# Altium project Astranis_Thermocouple.PrjPcb
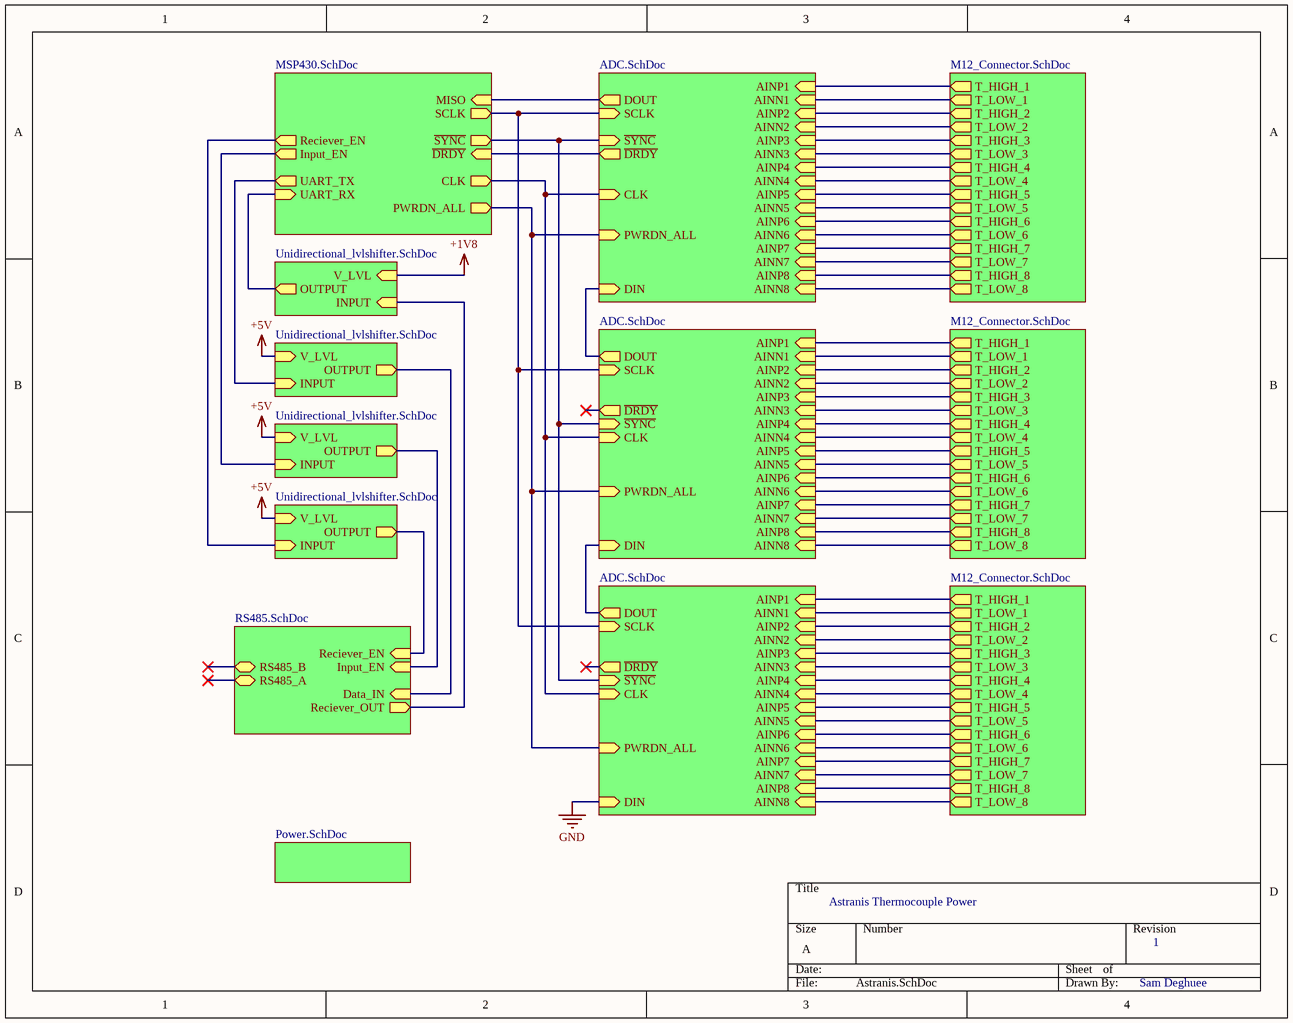
[diagram p0: Astranis.SchDoc]
7 sheets, 150 parts. Net scope: hierarchical (ports join the sheet entries above them; power ports are global).
Sheets:
  Astranis.SchDoc
    Designator = MSP430.SchDoc
    Designator = ADC.SchDoc
    Designator = M12_Connector.SchDoc
    Designator = ADC.SchDoc
    Designator = M12_Connector.SchDoc
    Designator = ADC.SchDoc
    Designator = M12_Connector.SchDoc
    Designator = Unidirectional_lvlshifter.SchDoc
    Designator = Unidirectional_lvlshifter.SchDoc
    Designator = RS485.SchDoc
    Designator = Unidirectional_lvlshifter.SchDoc
    Designator = Unidirectional_lvlshifter.SchDoc
    Designator = Power.SchDoc

## Sheet Astranis.SchDoc
size A

### Sub-sheets
Designator = MSP430.SchDoc: UART_TX (out), UART_RX (in), MISO (in), SCLK (out), PWRDN_ALL (out), ~{DRDY} (in), Input_EN (out), Reciever_EN (out), CLK (out), ~{SYNC} (out)
Designator = ADC.SchDoc: SCLK (in), ~{DRDY} (out), AINN8 (in), AINP3 (in), AINP5 (in), AINP7 (in), AINN7 (in), AINN5 (in), AINP2 (in), DOUT (out), PWRDN_ALL (in), AINN3 (in), AINN4 (in), AINN2 (in), AINN6 (in), AINP4 (in), AINP1 (in), ~{SYNC} (in), AINN1 (in), AINP6 (in), AINP8 (in), DIN (in), CLK (in)
Designator = M12_Connector.SchDoc: T_HIGH_1 (out), T_HIGH_5 (out), T_LOW_1 (out), T_HIGH_7 (out), T_LOW_2 (out), T_HIGH_4 (out), T_LOW_8 (out), T_LOW_3 (out), T_LOW_6 (out), T_HIGH_3 (out), T_HIGH_2 (out), T_HIGH_6 (out), T_LOW_7 (out), T_LOW_5 (out), T_LOW_4 (out), T_HIGH_8 (out)
Designator = ADC.SchDoc: SCLK (in), ~{DRDY} (out), AINN8 (in), AINP3 (in), AINP5 (in), AINP7 (in), AINN7 (in), AINN5 (in), AINP2 (in), DOUT (out), PWRDN_ALL (in), AINN3 (in), AINN4 (in), AINN2 (in), AINN6 (in), AINP4 (in), AINP1 (in), ~{SYNC} (in), AINN1 (in), AINP6 (in), AINP8 (in), DIN (in), CLK (in)
Designator = M12_Connector.SchDoc: T_HIGH_1 (out), T_HIGH_5 (out), T_LOW_1 (out), T_HIGH_7 (out), T_LOW_2 (out), T_HIGH_4 (out), T_LOW_8 (out), T_LOW_3 (out), T_LOW_6 (out), T_HIGH_3 (out), T_HIGH_2 (out), T_HIGH_6 (out), T_LOW_7 (out), T_LOW_5 (out), T_LOW_4 (out), T_HIGH_8 (out)
Designator = ADC.SchDoc: SCLK (in), ~{DRDY} (out), AINN8 (in), AINP3 (in), AINP5 (in), AINP7 (in), AINN7 (in), AINN5 (in), AINP2 (in), DOUT (out), PWRDN_ALL (in), AINN3 (in), AINN4 (in), AINN2 (in), AINN6 (in), AINP4 (in), AINP1 (in), ~{SYNC} (in), AINN1 (in), AINP6 (in), AINP8 (in), DIN (in), CLK (in)
Designator = M12_Connector.SchDoc: T_HIGH_1 (out), T_HIGH_5 (out), T_LOW_1 (out), T_HIGH_7 (out), T_LOW_2 (out), T_HIGH_4 (out), T_LOW_8 (out), T_LOW_3 (out), T_LOW_6 (out), T_HIGH_3 (out), T_HIGH_2 (out), T_HIGH_6 (out), T_LOW_7 (out), T_LOW_5 (out), T_LOW_4 (out), T_HIGH_8 (out)
Designator = Unidirectional_lvlshifter.SchDoc: V_LVL (in), OUTPUT (out), INPUT (in)
Designator = Unidirectional_lvlshifter.SchDoc: V_LVL (in), OUTPUT (out), INPUT (in)
Designator = RS485.SchDoc: RS485_B (bidir), Input_EN (in), Reciever_EN (in), Reciever_OUT (out), Data_IN (in), RS485_A (bidir)
Designator = Unidirectional_lvlshifter.SchDoc: V_LVL (in), OUTPUT (out), INPUT (in)
Designator = Unidirectional_lvlshifter.SchDoc: V_LVL (in), OUTPUT (out), INPUT (in)
Designator = Power.SchDoc: no entries

### Nets
+5V: sheet Designator/V_LVL, sheet Designator/V_LVL, sheet Designator/V_LVL
GND: sheet Designator/AINN8, sheet Designator/AINN7, sheet Designator/AINN5, sheet Designator/AINN3, sheet Designator/AINN4, sheet Designator/AINN2, sheet Designator/AINN6, sheet Designator/AINN1, sheet Designator/T_LOW_1, sheet Designator/T_LOW_2, sheet Designator/T_LOW_8, sheet Designator/T_LOW_3, sheet Designator/T_LOW_6, sheet Designator/T_LOW_7, sheet Designator/T_LOW_5, sheet Designator/T_LOW_4, sheet Designator/AINN8, sheet Designator/AINN7, sheet Designator/AINN5, sheet Designator/AINN3, sheet Designator/AINN4, sheet Designator/AINN2, sheet Designator/AINN6, sheet Designator/AINN1, sheet Designator/T_LOW_1, sheet Designator/T_LOW_2, sheet Designator/T_LOW_8, sheet Designator/T_LOW_3, sheet Designator/T_LOW_6, sheet Designator/T_LOW_7, sheet Designator/T_LOW_5, sheet Designator/T_LOW_4, sheet Designator/AINN8, sheet Designator/AINN7, sheet Designator/AINN5, sheet Designator/AINN3, sheet Designator/AINN4, sheet Designator/AINN2, sheet Designator/AINN6, sheet Designator/AINN1, sheet Designator/DIN, sheet Designator/T_LOW_1, sheet Designator/T_LOW_2, sheet Designator/T_LOW_8, sheet Designator/T_LOW_3, sheet Designator/T_LOW_6, sheet Designator/T_LOW_7, sheet Designator/T_LOW_5, sheet Designator/T_LOW_4
CLK: sheet Designator/CLK, sheet Designator/CLK, sheet Designator/CLK, sheet Designator/CLK
UART_RX: sheet Designator/UART_RX, sheet Designator/OUTPUT
UART_TX: sheet Designator/UART_TX, sheet Designator/INPUT
NetJ1_Designator#1_?1: sheet Designator/AINP1, sheet Designator/T_HIGH_1
NetJ1_Designator#2_?1: sheet Designator/AINP1, sheet Designator/T_HIGH_1
NetJ1_Designator#3_?1: sheet Designator/AINP1, sheet Designator/T_HIGH_1
NetJ2_Designator#1_?1: sheet Designator/AINP5, sheet Designator/T_HIGH_5
NetJ2_Designator#2_?1: sheet Designator/AINP5, sheet Designator/T_HIGH_5
NetJ2_Designator#3_?1: sheet Designator/AINP5, sheet Designator/T_HIGH_5
NetJ3_Designator#1_?1: sheet Designator/AINP2, sheet Designator/T_HIGH_2
NetJ3_Designator#2_?1: sheet Designator/AINP2, sheet Designator/T_HIGH_2
NetJ3_Designator#3_?1: sheet Designator/AINP2, sheet Designator/T_HIGH_2
NetJ4_Designator#1_?1: sheet Designator/AINP6, sheet Designator/T_HIGH_6
NetJ4_Designator#2_?1: sheet Designator/AINP6, sheet Designator/T_HIGH_6
NetJ4_Designator#3_?1: sheet Designator/AINP6, sheet Designator/T_HIGH_6
NetJ5_Designator#1_?1: sheet Designator/AINP3, sheet Designator/T_HIGH_3
NetJ5_Designator#2_?1: sheet Designator/AINP3, sheet Designator/T_HIGH_3
NetJ5_Designator#3_?1: sheet Designator/AINP3, sheet Designator/T_HIGH_3
NetJ6_Designator#1_?1: sheet Designator/AINP7, sheet Designator/T_HIGH_7
NetJ6_Designator#2_?1: sheet Designator/AINP7, sheet Designator/T_HIGH_7
NetJ6_Designator#3_?1: sheet Designator/AINP7, sheet Designator/T_HIGH_7
NetJ7_Designator#1_?1: sheet Designator/AINP4, sheet Designator/T_HIGH_4
NetJ7_Designator#2_?1: sheet Designator/AINP4, sheet Designator/T_HIGH_4
NetJ7_Designator#3_?1: sheet Designator/AINP4, sheet Designator/T_HIGH_4
NetJ8_Designator#1_?1: sheet Designator/AINP8, sheet Designator/T_HIGH_8
NetJ8_Designator#2_?1: sheet Designator/AINP8, sheet Designator/T_HIGH_8
NetJ8_Designator#3_?1: sheet Designator/AINP8, sheet Designator/T_HIGH_8
NetQ1_Designator#2_3: sheet Designator/OUTPUT, sheet Designator/Data_IN
NetQ1_Designator#3_3: sheet Designator/Reciever_EN, sheet Designator/OUTPUT
NetQ1_Designator#4_3: sheet Designator/Input_EN, sheet Designator/OUTPUT
NetR12_Designator#1_1: sheet Designator/INPUT, sheet Designator/Reciever_OUT
NetR12_Designator#3_1: sheet Designator/Reciever_EN, sheet Designator/INPUT
NetR12_Designator#4_1: sheet Designator/Input_EN, sheet Designator/INPUT
NetU1_Designator#1_?1: sheet Designator/DIN, sheet Designator/DOUT
NetU1_Designator#1_?2: sheet Designator/~{DRDY}, sheet Designator/~{DRDY}
NetU1_Designator#1_?4: sheet Designator/~{SYNC}, sheet Designator/~{SYNC}, sheet Designator/~{SYNC}, sheet Designator/~{SYNC}
NetU1_Designator#1_?13: sheet Designator/PWRDN_ALL, sheet Designator/PWRDN_ALL, sheet Designator/PWRDN_ALL, sheet Designator/PWRDN_ALL
NetU1_Designator#1_?24: sheet Designator/MISO, sheet Designator/DOUT
NetU1_Designator#1_SCLK: sheet Designator/SCLK, sheet Designator/SCLK, sheet Designator/SCLK, sheet Designator/SCLK
NetU1_Designator#2_?1: sheet Designator/DIN, sheet Designator/DOUT

### Notes on the sheet
- Astranis Thermocouple Power
- 1
- Sam Deghuee

## Sheet MSP430.SchDoc
size A
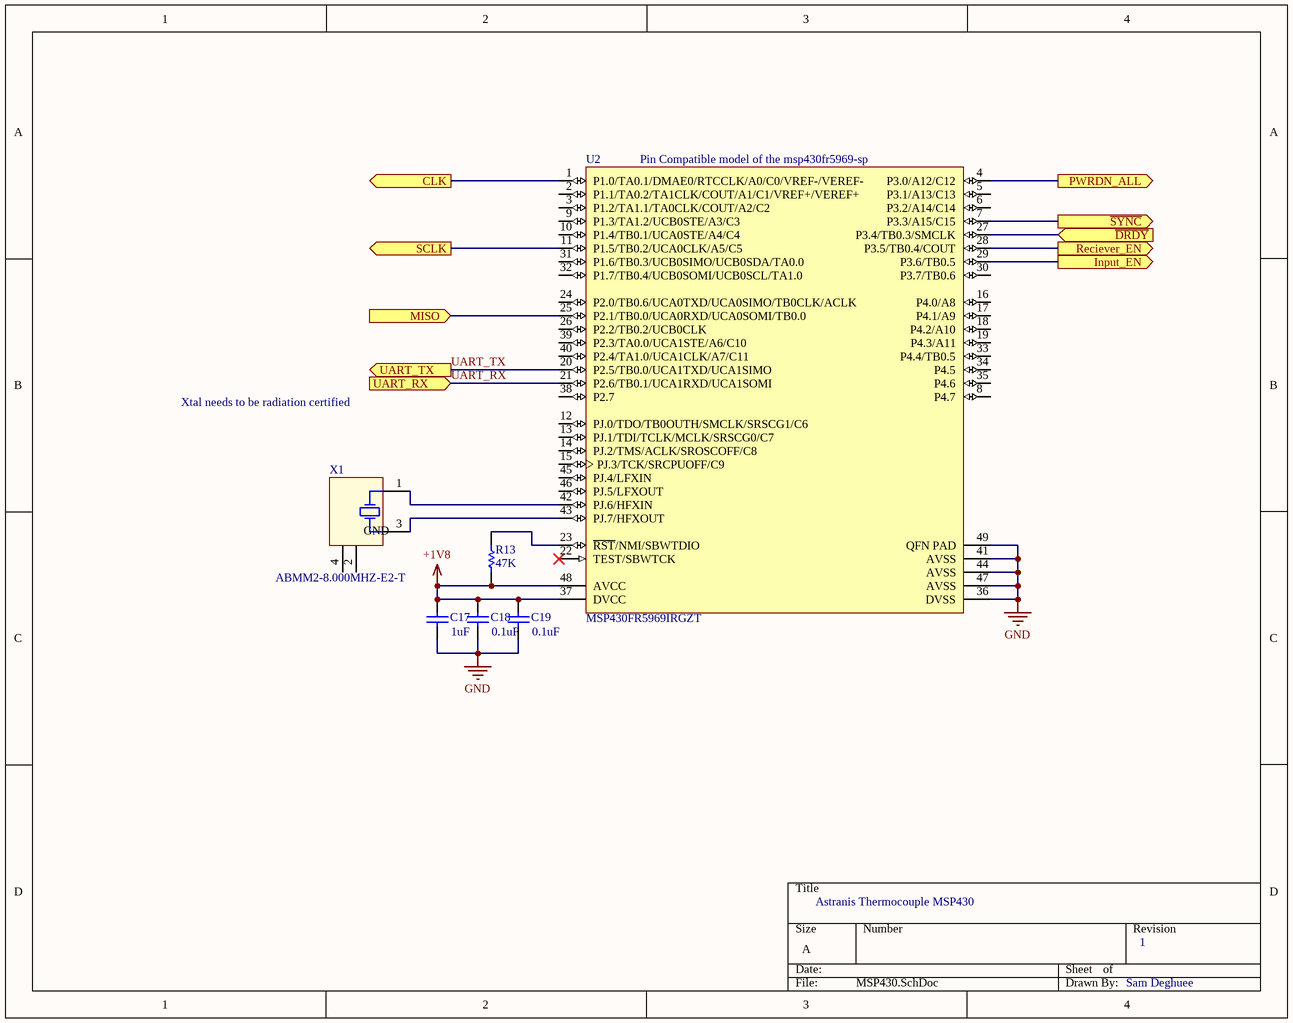
[diagram p1: MSP430.SchDoc]

### Parts
C17  value 1uF  [CAPC0603(1608)100_L]  (hidden comment: CAP0603)
C18  value 0.1uF  [CAPC0603(1608)100_L]  (hidden comment: CAP0603)
C19  value 0.1uF  [CAPC0603(1608)100_L]  (hidden comment: CAP0603)
R13  value 47K  [RESC0603(1608)_L]  (hidden comment: RES0603)
U2  MSP430FR5969IRGZT  [RGZ0048B_V]
X1  ABMM2-8.000MHZ-E2-T  [ABRA-ABMM2-4_V]

### Ports
CLK (out), Input_EN (out), MISO (in), PWRDN_ALL (out), Reciever_EN (out), SCLK (out), UART_RX (in), UART_TX (out), ~{DRDY} (in), ~{SYNC} (out)

### Nets
+1V8: C17.2 C18.2 C19.2 R13.2 U2.37(DVCC) U2.48(AVCC)
GND: C17.1 C18.1 C19.1 U2.36(DVSS) U2.41(AVSS) U2.44(AVSS) U2.47(AVSS) U2.49(QFN_PAD)
CLK: U2.1(P1.0/TA0.1/DMAE0/RTCCLK/A0/C0/VREF-/VEREF-) ; port CLK
UART_RX: U2.21(P2.6/TB0.1/UCA1RXD/UCA1SOMI) ; port UART_RX
UART_TX: U2.20(P2.5/TB0.0/UCA1TXD/UCA1SIMO) ; port UART_TX
NetR12_Designator#3_1: U2.28(P3.5/TB0.4/COUT) ; port Reciever_EN
NetR12_Designator#4_1: U2.29(P3.6/TB0.5) ; port Input_EN
NetR13_1: R13.1 U2.23(~{RST}/NMI/SBWTDIO)
NetU1_Designator#1_?2: U2.27(P3.4/TB0.3/SMCLK) ; port ~{DRDY}
NetU1_Designator#1_?4: U2.7(P3.3/A15/C15) ; port ~{SYNC}
NetU1_Designator#1_?13: U2.4(P3.0/A12/C12) ; port PWRDN_ALL
NetU1_Designator#1_?24: U2.25(P2.1/TB0.0/UCA0RXD/UCA0SOMI/TB0.0) ; port MISO
NetU1_Designator#1_SCLK: U2.11(P1.5/TB0.2/UCA0CLK/A5/C5) ; port SCLK
NetU2_42: U2.42(PJ.6/HFXIN) X1.1(X1)
NetU2_43: U2.43(PJ.7/HFXOUT) X1.3(X2)

Not connected (* = marked no-connect by the designer): U2 2(P1.1/TA0.2/TA1CLK/COUT/A1/C1/VREF+/VEREF+) 3(P1.2/TA1.1/TA0CLK/COUT/A2/C2) 5(P3.1/A13/C13) 6(P3.2/A14/C14) 8(P4.7) 9(P1.3/TA1.2/UCB0STE/A3/C3) 10(P1.4/TB0.1/UCA0STE/A4/C4) 12(PJ.0/TDO/TB0OUTH/SMCLK/SRSCG1/C6) 13(PJ.1/TDI/TCLK/MCLK/SRSCG0/C7) 14(PJ.2/TMS/ACLK/SROSCOFF/C8) 15(PJ.3/TCK/SRCPUOFF/C9) 16(P4.0/A8) 17(P4.1/A9) 18(P4.2/A10) 19(P4.3/A11) 22(TEST/SBWTCK)* 24(P2.0/TB0.6/UCA0TXD/UCA0SIMO/TB0CLK/ACLK) 26(P2.2/TB0.2/UCB0CLK) 30(P3.7/TB0.6) 31(P1.6/TB0.3/UCB0SIMO/UCB0SDA/TA0.0) 32(P1.7/TB0.4/UCB0SOMI/UCB0SCL/TA1.0) 33(P4.4/TB0.5) 34(P4.5) 35(P4.6) 38(P2.7) 39(P2.3/TA0.0/UCA1STE/A6/C10) 40(P2.4/TA1.0/UCA1CLK/A7/C11) 45(PJ.4/LFXIN) 46(PJ.5/LFXOUT); X1 2(GND) 4(GND)

### Notes on the sheet
- (near U2) Pin Compatible model of the msp430fr5969-sp
- Xtal needs to be radiation certified
- Astranis Thermocouple MSP430
- 1
- Sam Deghuee

### Library data of the parts
C17-C19 = CMP-1590-00005-1: 0603 (1608 Metric) Chip Capacitor; Case-Metric: 1608; Case-EIA: 0603; PackageReference: CAPC0603(1608)100
R13 = CMP-1591-00001-1: 0603 (1608 Metric) Chip Resistor; Case-Metric: 1608; Case-EIA: 0603; PackageReference: RESC0603(1608)
U2 = CMP-2000-06762-1: 16 MHz Mixed Signal Microcontroller with 2 KB SRAM and 40 GPIOs, -40 to 85 degC, 48-Pin QFN (RGZ), Green (RoHS & no Sb/Br), Tape and Reel; Manufacturer: Texas Instruments; Maximum Frequency: 16MHz; Number of SPI Channels: 3; ADC Channels: 16; Device Core: MSP430; ADC Resolution: 12bit; Program Memory Size: 64kB; Number of UART Channels: 2; ADCs: 1(16x12bit); Data Bus Width: 16bit; Number of ADC Units: 1; Timers: 5x16bit; Instruction Set Architecture: RISC; Program Memory Type: Flash; RAM Size: 2kB; Typical Operating Supply Voltage: 1.8→3.6V; Number of Timers: 5; Pin Count: 48; Width: 7.15mm; Package Type: VQFN; Minimum Operating Temperature: -40°C; Maximum Operating Temperature: +85°C; Datasheet URL: http://www.ti.com/lit/ds/symlink/msp430fr5969.pdf; Mounting Type: SurfaceMount; Package Description: 48-Pin Quad Flat No-lead Package, Body 7 x 7 mm, Pitch 0.5 mm; Timer Resolution: 16bit; Manufacturer URL: http://www.ti.com/; Height: 0.95mm; Datasheet Version: Rev. E, 03/2015; Dimensions: 7.15x7.15x0.95mm; Mounting Technology: SurfaceMount; Package Reference: RGZ48-4100X4100TP; Number of I2C Channels: 1; Family Name: MSP430; Length: 7.15mm; Number of LIN Channels: 2; ComponentLink1Description: Space Datasheet; ComponentLink1URL: http://www.ti.com/lit/ds/symlink/msp430fr5969-sp.pdf
X1 = CMP-0277-00003-1: Ceramic Surface Mount Low Profile Quartz Crystal, 8 MHz, -20 to 70 degC, 4-Pin 6 x 3.6 x 1.2 mm SMD, RoHS, 1000pcs / Reel; Manufacturer: Abracon; ESR: 72 Ohm Max.; Frequency: 8 MHz; Shunt Capacitance C0: 7 pF Max.; Load Capacitance CL: 18 pF Typ.; ComponentLink3Description: Package Specification; PackageDescription: 4-Pin SMD, Body 6 x 3.6 mm, Pitch 4.4 mm; DatasheetVersion: Jan-13; ComponentLink1URL: http://www.abracon.com/; ComponentLink2URL: http://www.abracon.com/Resonators/ABMM2.pdf; Temperature Range: -20 to 70 degC; Mounting Technology: Surface Mount; RoHS: TRUE; PartNumber: ABMM2-8.000MHZ-E2-T; ComponentLink2Description: Datasheet; ComponentLink3URL: http://www.abracon.com/Resonators/ABMM2.pdf; ComponentLink1Description: Manufacturer URL; Packing: 1000pcs / Reel

## Sheet ADC.SchDoc
size A
Used 3 times, as channels Designator, Designator, Designator. Parts and nets are listed once, with the designators drawn on the sheet.
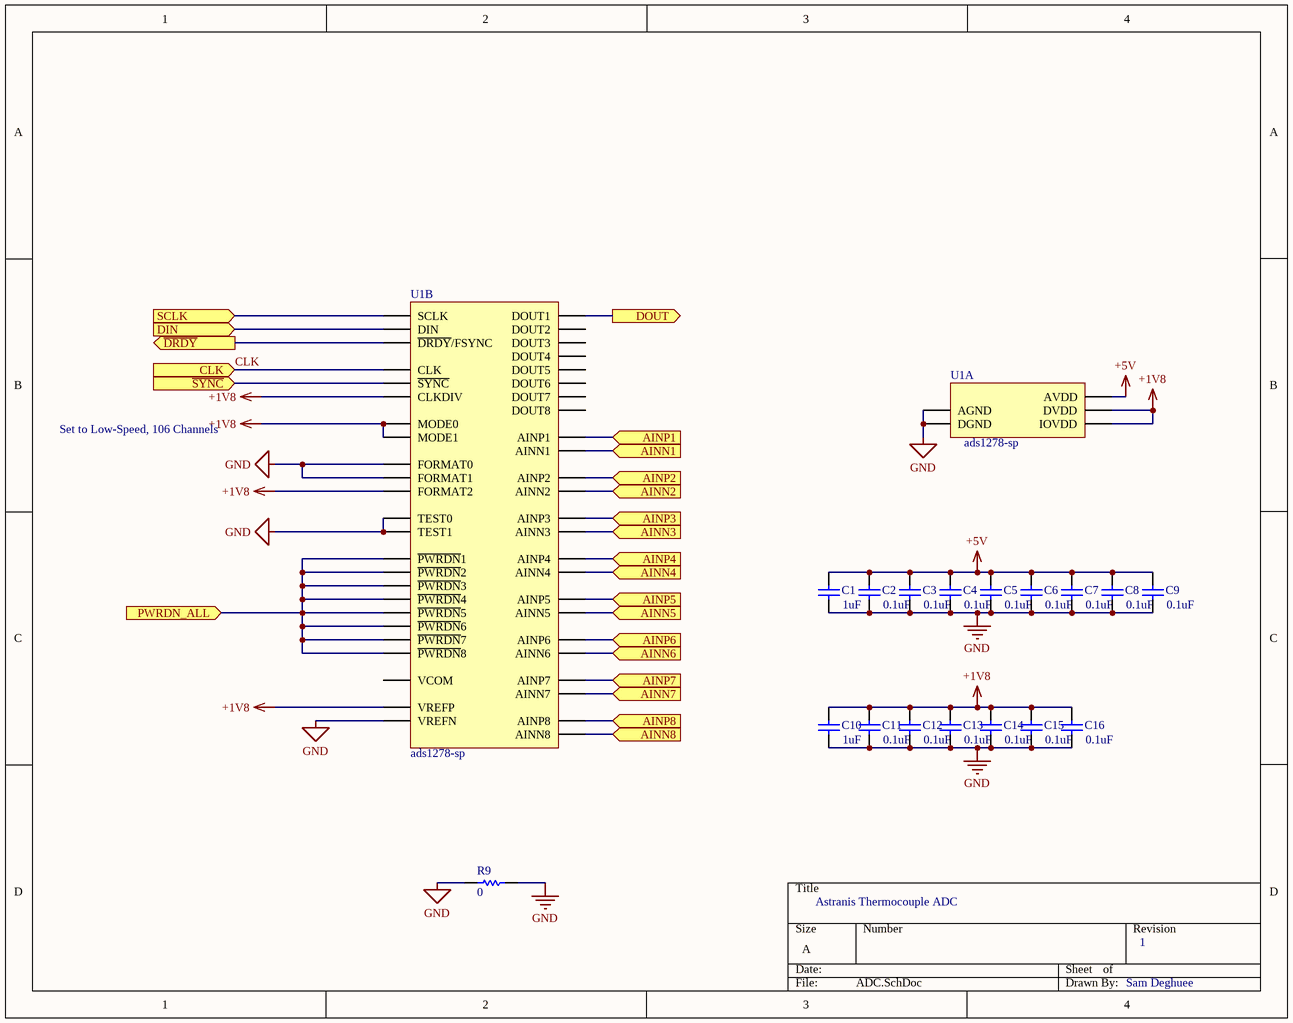
[diagram p2: ADC.SchDoc]

### Parts
C1  value 1uF  [CAPC0603(1608)100_L]  (hidden comment: CAP0603)
C2  value 0.1uF  [CAPC0603(1608)100_L]  (hidden comment: CAP0603)
C3  value 0.1uF  [CAPC0603(1608)100_L]  (hidden comment: CAP0603)
C4  value 0.1uF  [CAPC0603(1608)100_L]  (hidden comment: CAP0603)
C5  value 0.1uF  [CAPC0603(1608)100_L]  (hidden comment: CAP0603)
C6  value 0.1uF  [CAPC0603(1608)100_L]  (hidden comment: CAP0603)
C7  value 0.1uF  [CAPC0603(1608)100_L]  (hidden comment: CAP0603)
C8  value 0.1uF  [CAPC0603(1608)100_L]  (hidden comment: CAP0603)
C9  value 0.1uF  [CAPC0603(1608)100_L]  (hidden comment: CAP0603)
C10  value 1uF  [CAPC0603(1608)100_L]  (hidden comment: CAP0603)
C11  value 0.1uF  [CAPC0603(1608)100_L]  (hidden comment: CAP0603)
C12  value 0.1uF  [CAPC0603(1608)100_L]  (hidden comment: CAP0603)
C13  value 0.1uF  [CAPC0603(1608)100_L]  (hidden comment: CAP0603)
C14  value 0.1uF  [CAPC0603(1608)100_L]  (hidden comment: CAP0603)
C15  value 0.1uF  [CAPC0603(1608)100_L]  (hidden comment: CAP0603)
C16  value 0.1uF  [CAPC0603(1608)100_L]  (hidden comment: CAP0603)
R9  value 0  [RESC0603(1608)_L]  (hidden comment: RES0603)
U1  ads1278-sp  (parts A,B of 2)

### Ports
AINN1 (in), AINN2 (in), AINN3 (in), AINN4 (in), AINN5 (in), AINN6 (in), AINN7 (in), AINN8 (in), AINP1 (in), AINP2 (in), AINP3 (in), AINP4 (in), AINP5 (in), AINP6 (in), AINP7 (in), AINP8 (in), CLK (in), DIN (in), DOUT (out), PWRDN_ALL (in), SCLK (in), ~{DRDY} (out), ~{SYNC} (in)

### Nets
+1V8: C10.2 C11.2 C12.2 C13.2 C14.2 C15.2 C16.2 U1.?5(CLKDIV) U1.?6(MODE0) U1.?7(MODE1) U1.?10(FORMAT2) U1.?22(VREFP) U1.DVDD U1.IOVDD
+5V: C1.2 C2.2 C3.2 C4.2 C5.2 C6.2 C7.2 C8.2 C9.2 U1.AVDD
GND: C1.1 C2.1 C3.1 C4.1 C5.1 C6.1 C7.1 C8.1 C9.1 C10.1 C11.1 C12.1 C13.1 C14.1 C15.1 C16.1 R9.1 R9.2 U1.?8(FORMAT0) U1.?9(FORMAT1) U1.?11(TEST0) U1.?12(TEST1) U1.?23(VREFN) U1.AGND U1.DGND
AINN1: U1.?40(AINN1) ; port AINN1
AINN2: U1.?41(AINN2) ; port AINN2
AINN3: U1.?42(AINN3) ; port AINN3
AINN4: U1.?43(AINN4) ; port AINN4
AINN5: U1.?44(AINN5) ; port AINN5
AINN6: U1.?45(AINN6) ; port AINN6
AINN7: U1.?46(AINN7) ; port AINN7
AINN8: U1.?47(AINN8) ; port AINN8
AINP1: U1.?32(AINP1) ; port AINP1
AINP2: U1.?33(AINP2) ; port AINP2
AINP3: U1.?34(AINP3) ; port AINP3
AINP4: U1.?35(AINP4) ; port AINP4
AINP5: U1.?36(AINP5) ; port AINP5
AINP6: U1.?37(AINP6) ; port AINP6
AINP7: U1.?38(AINP7) ; port AINP7
AINP8: U1.?39(AINP8) ; port AINP8
CLK: U1.?3(CLK) ; port CLK
~{DRDY}: U1.?2(~{DRDY}/FSYNC) ; port ~{DRDY}
DIN: U1.?1(DIN) ; port DIN
DOUT: U1.?24(DOUT1) ; port DOUT
PWRDN_ALL: U1.?13(~{PWRDN}1) U1.?14(~{PWRDN}2) U1.?15(~{PWRDN}3) U1.?16(~{PWRDN}4) U1.?17(~{PWRDN}5) U1.?18(~{PWRDN}6) U1.?19(~{PWRDN}7) U1.?20(~{PWRDN}8) ; port PWRDN_ALL
~{SYNC}: U1.?4(~{SYNC}) ; port ~{SYNC}
SCLK: U1.SCLK ; port SCLK

Not connected (* = marked no-connect by the designer): U1 ?21(VCOM) ?25(DOUT2) ?26(DOUT3) ?27(DOUT4) ?28(DOUT5) ?29(DOUT6) ?30(DOUT7) ?31(DOUT8)

### Channels
Designator: designators end in _Designator#1; ports AINN1=GND AINN2=GND AINN3=GND AINN4=GND AINN5=GND AINN6=GND AINN7=GND AINN8=GND AINP1=NetJ1_Designator#1_?1 AINP2=NetJ3_Designator#1_?1 AINP3=NetJ5_Designator#1_?1 AINP4=NetJ7_Designator#1_?1 AINP5=NetJ2_Designator#1_?1 AINP6=NetJ4_Designator#1_?1 AINP7=NetJ6_Designator#1_?1 AINP8=NetJ8_Designator#1_?1 CLK=CLK DIN=NetU1_Designator#1_?1 DOUT=NetU1_Designator#1_?24 PWRDN_ALL=NetU1_Designator#1_?13 SCLK=NetU1_Designator#1_SCLK ~{DRDY}=NetU1_Designator#1_?2 ~{SYNC}=NetU1_Designator#1_?4
Designator: designators end in _Designator#2; ports AINN1=GND AINN2=GND AINN3=GND AINN4=GND AINN5=GND AINN6=GND AINN7=GND AINN8=GND AINP1=NetJ1_Designator#2_?1 AINP2=NetJ3_Designator#2_?1 AINP3=NetJ5_Designator#2_?1 AINP4=NetJ7_Designator#2_?1 AINP5=NetJ2_Designator#2_?1 AINP6=NetJ4_Designator#2_?1 AINP7=NetJ6_Designator#2_?1 AINP8=NetJ8_Designator#2_?1 CLK=CLK DIN=NetU1_Designator#2_?1 DOUT=NetU1_Designator#1_?1 PWRDN_ALL=NetU1_Designator#1_?13 SCLK=NetU1_Designator#1_SCLK ~{DRDY}=NetU1_Designator#2_?2 ~{SYNC}=NetU1_Designator#1_?4
Designator: designators end in _Designator#3; ports AINN1=GND AINN2=GND AINN3=GND AINN4=GND AINN5=GND AINN6=GND AINN7=GND AINN8=GND AINP1=NetJ1_Designator#3_?1 AINP2=NetJ3_Designator#3_?1 AINP3=NetJ5_Designator#3_?1 AINP4=NetJ7_Designator#3_?1 AINP5=NetJ2_Designator#3_?1 AINP6=NetJ4_Designator#3_?1 AINP7=NetJ6_Designator#3_?1 AINP8=NetJ8_Designator#3_?1 CLK=CLK DIN=GND DOUT=NetU1_Designator#2_?1 PWRDN_ALL=NetU1_Designator#1_?13 SCLK=NetU1_Designator#1_SCLK ~{DRDY}=NetU1_Designator#3_?2 ~{SYNC}=NetU1_Designator#1_?4

### Notes on the sheet
- Set to Low-Speed, 106 Channels
- Astranis Thermocouple ADC
- 1
- Sam Deghuee

### Library data of the parts
C1-C16 = CMP-1590-00005-1: as C17 on sheet MSP430; PackageReference: CAPC0603(1608)100
R9 = CMP-1591-00001-1: as R13 on sheet MSP430; PackageReference: RESC0603(1608)
U1 = ads1278-sp: The ADS1278-SP (octal) is a 24-bit, delta-sigma (ΔΣ) analog-to-digital converter (ADC) with data rates up to 128k samples per second (SPS), allowing simultaneous sampling of eight channels.; ComponentLink1Description: Datasheet; ComponentLink1URL: http://www.ti.com/lit/ds/symlink/ads1278-sp.pdf

## Sheet M12_Connector.SchDoc
size A
Used 3 times, as channels Designator, Designator, Designator. Parts and nets are listed once, with the designators drawn on the sheet.
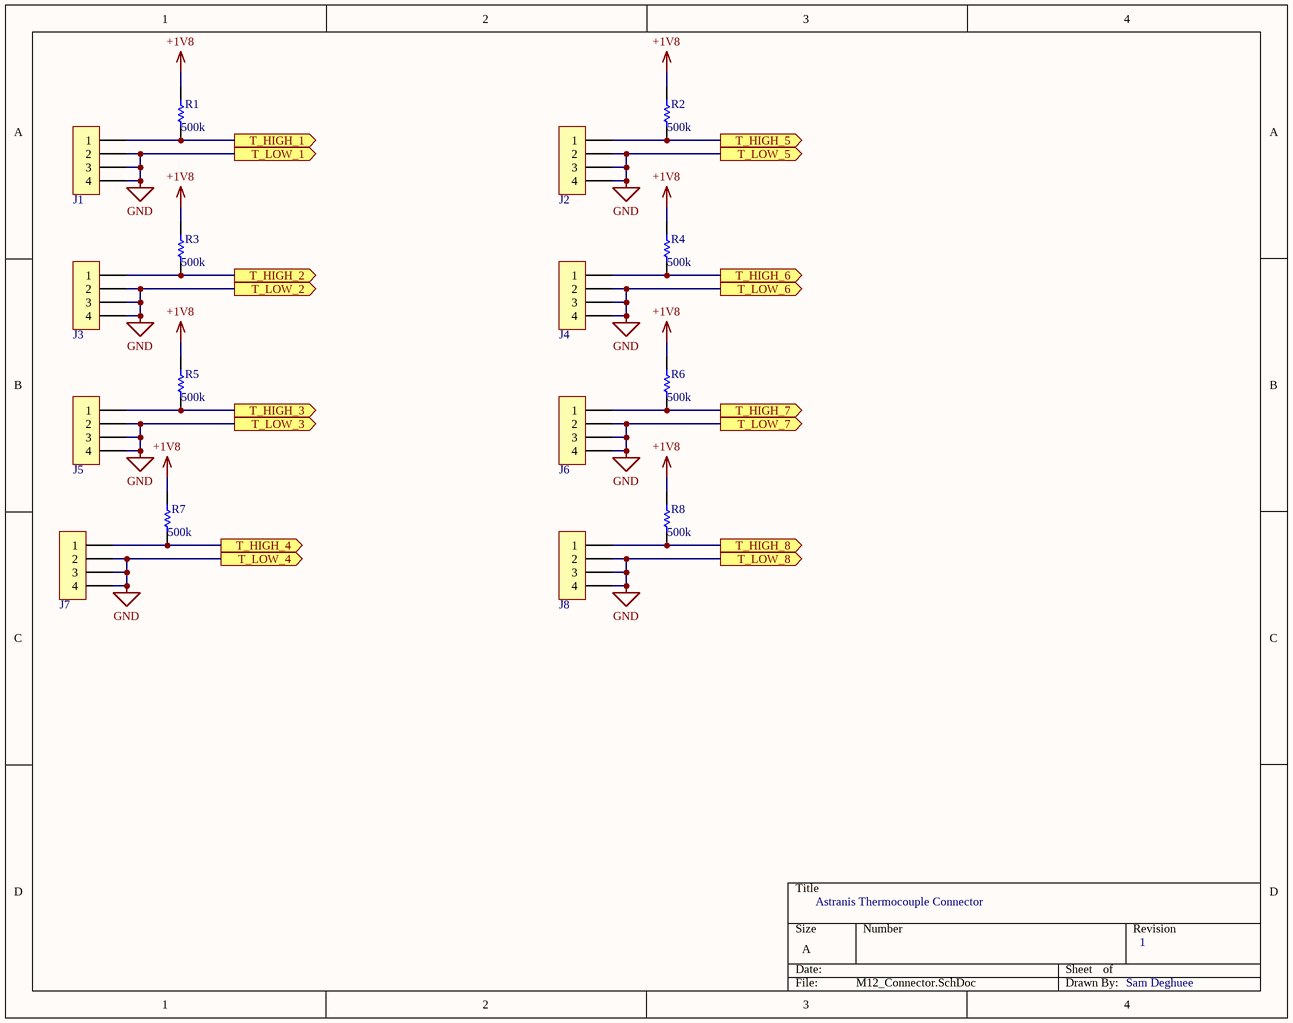
[diagram p3: M12_Connector.SchDoc]

### Parts
J1  M12 PCB Pannel Mount  (value not drawn)
J2  M12 PCB Pannel Mount  (value not drawn)
J3  M12 PCB Pannel Mount  (value not drawn)
J4  M12 PCB Pannel Mount  (value not drawn)
J5  M12 PCB Pannel Mount  (value not drawn)
J6  M12 PCB Pannel Mount  (value not drawn)
J7  M12 PCB Pannel Mount  (value not drawn)
J8  M12 PCB Pannel Mount  (value not drawn)
R1  value 500k  [RESC0603(1608)_L]  (hidden comment: RES0603)
R2  value 500k  [RESC0603(1608)_L]  (hidden comment: RES0603)
R3  value 500k  [RESC0603(1608)_L]  (hidden comment: RES0603)
R4  value 500k  [RESC0603(1608)_L]  (hidden comment: RES0603)
R5  value 500k  [RESC0603(1608)_L]  (hidden comment: RES0603)
R6  value 500k  [RESC0603(1608)_L]  (hidden comment: RES0603)
R7  value 500k  [RESC0603(1608)_L]  (hidden comment: RES0603)
R8  value 500k  [RESC0603(1608)_L]  (hidden comment: RES0603)

### Ports
T_HIGH_1 (out), T_HIGH_2 (out), T_HIGH_3 (out), T_HIGH_4 (out), T_HIGH_5 (out), T_HIGH_6 (out), T_HIGH_7 (out), T_HIGH_8 (out), T_LOW_1 (out), T_LOW_2 (out), T_LOW_3 (out), T_LOW_4 (out), T_LOW_5 (out), T_LOW_6 (out), T_LOW_7 (out), T_LOW_8 (out)

### Nets
+1V8: R1.2 R2.2 R3.2 R4.2 R5.2 R6.2 R7.2 R8.2
GND: J1.?2(2) J1.?3(3) J1.?4(4) J2.?2(2) J2.?3(3) J2.?4(4) J3.?2(2) J3.?3(3) J3.?4(4) J4.?2(2) J4.?3(3) J4.?4(4) J5.?2(2) J5.?3(3) J5.?4(4) J6.?2(2) J6.?3(3) J6.?4(4) J7.?2(2) J7.?3(3) J7.?4(4) J8.?2(2) J8.?3(3) J8.?4(4) ; port T_LOW_1, port T_LOW_2, port T_LOW_3, port T_LOW_4, port T_LOW_5, port T_LOW_6, port T_LOW_7, port T_LOW_8
T_HIGH_1: J1.?1(1) R1.1 ; port T_HIGH_1
T_HIGH_2: J3.?1(1) R3.1 ; port T_HIGH_2
T_HIGH_3: J5.?1(1) R5.1 ; port T_HIGH_3
T_HIGH_4: J7.?1(1) R7.1 ; port T_HIGH_4
T_HIGH_5: J2.?1(1) R2.1 ; port T_HIGH_5
T_HIGH_6: J4.?1(1) R4.1 ; port T_HIGH_6
T_HIGH_7: J6.?1(1) R6.1 ; port T_HIGH_7
T_HIGH_8: J8.?1(1) R8.1 ; port T_HIGH_8

### Channels
Designator: designators end in _Designator#1; ports T_HIGH_1=NetJ1_Designator#1_?1 T_HIGH_2=NetJ3_Designator#1_?1 T_HIGH_3=NetJ5_Designator#1_?1 T_HIGH_4=NetJ7_Designator#1_?1 T_HIGH_5=NetJ2_Designator#1_?1 T_HIGH_6=NetJ4_Designator#1_?1 T_HIGH_7=NetJ6_Designator#1_?1 T_HIGH_8=NetJ8_Designator#1_?1 T_LOW_1=GND T_LOW_2=GND T_LOW_3=GND T_LOW_4=GND T_LOW_5=GND T_LOW_6=GND T_LOW_7=GND T_LOW_8=GND
Designator: designators end in _Designator#2; ports T_HIGH_1=NetJ1_Designator#2_?1 T_HIGH_2=NetJ3_Designator#2_?1 T_HIGH_3=NetJ5_Designator#2_?1 T_HIGH_4=NetJ7_Designator#2_?1 T_HIGH_5=NetJ2_Designator#2_?1 T_HIGH_6=NetJ4_Designator#2_?1 T_HIGH_7=NetJ6_Designator#2_?1 T_HIGH_8=NetJ8_Designator#2_?1 T_LOW_1=GND T_LOW_2=GND T_LOW_3=GND T_LOW_4=GND T_LOW_5=GND T_LOW_6=GND T_LOW_7=GND T_LOW_8=GND
Designator: designators end in _Designator#3; ports T_HIGH_1=NetJ1_Designator#3_?1 T_HIGH_2=NetJ3_Designator#3_?1 T_HIGH_3=NetJ5_Designator#3_?1 T_HIGH_4=NetJ7_Designator#3_?1 T_HIGH_5=NetJ2_Designator#3_?1 T_HIGH_6=NetJ4_Designator#3_?1 T_HIGH_7=NetJ6_Designator#3_?1 T_HIGH_8=NetJ8_Designator#3_?1 T_LOW_1=GND T_LOW_2=GND T_LOW_3=GND T_LOW_4=GND T_LOW_5=GND T_LOW_6=GND T_LOW_7=GND T_LOW_8=GND

### Notes on the sheet
- Astranis Thermocouple Connector
- 1
- Sam Deghuee

### Library data of the parts
J1-J8 = M12: M12,REAR MOUNTING,MALE,A CODE,4P
R1-R8 = CMP-1591-00001-1: as R13 on sheet MSP430; PackageReference: RESC0603(1608)

## Sheet Unidirectional_lvlshifter.SchDoc
size A
Used 4 times, as channels Designator, Designator, Designator, Designator. Parts and nets are listed once, with the designators drawn on the sheet.
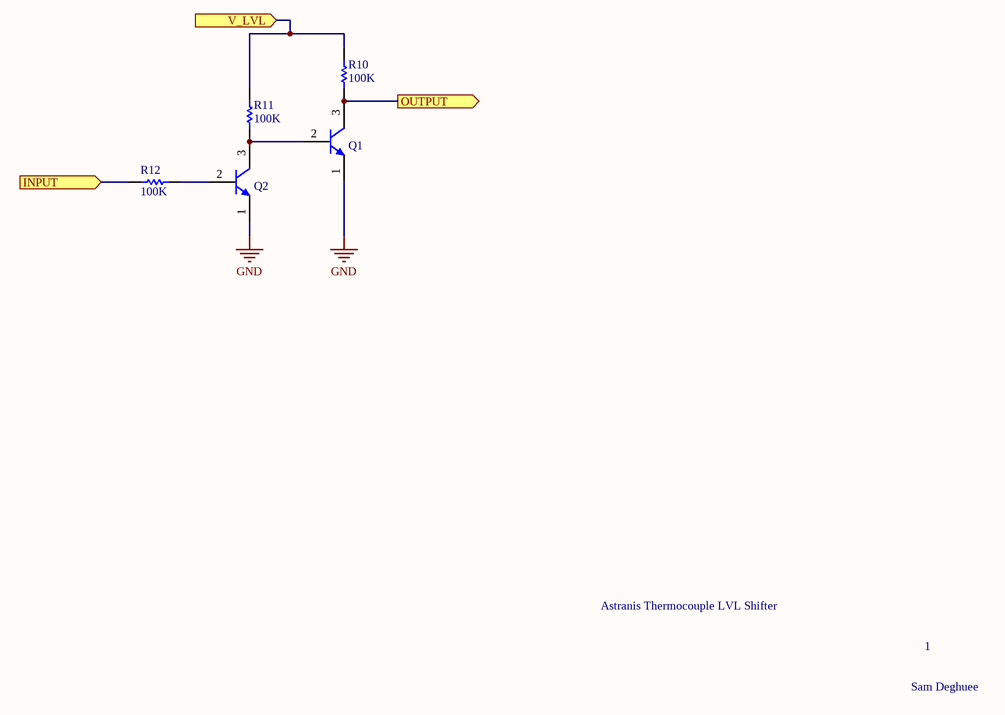
[diagram p4: Unidirectional_lvlshifter.SchDoc]

### Parts
Q1  MPSA18G  [ONSC-TO-92-3-29-11]  (value not drawn)
Q2  MPSA18G  [ONSC-TO-92-3-29-11]  (value not drawn)
R10  value 100K  [RESC0603(1608)_L]  (hidden comment: RES0603)
R11  value 100K  [RESC0603(1608)_L]  (hidden comment: RES0603)
R12  value 100K  [RESC0603(1608)_L]  (hidden comment: RES0603)

### Ports
INPUT (in), OUTPUT (out), V_LVL (in)

### Nets
GND: Q1.1(E) Q2.1(E)
INPUT: R12.1 ; port INPUT
OUTPUT: Q1.3(C) R10.2 ; port OUTPUT
V_LVL: R10.1 R11.1 ; port V_LVL
NetQ1_2: Q1.2(B) Q2.3(C) R11.2
NetQ2_2: Q2.2(B) R12.2

### Channels
Designator: designators end in _Designator#1; ports INPUT=NetR12_Designator#1_1 OUTPUT=UART_RX V_LVL=+1V8
Designator: designators end in _Designator#2; ports INPUT=UART_TX OUTPUT=NetQ1_Designator#2_3 V_LVL=+5V
Designator: designators end in _Designator#3; ports INPUT=NetR12_Designator#3_1 OUTPUT=NetQ1_Designator#3_3 V_LVL=+5V
Designator: designators end in _Designator#4; ports INPUT=NetR12_Designator#4_1 OUTPUT=NetQ1_Designator#4_3 V_LVL=+5V

### Notes on the sheet
- Astranis Thermocouple LVL Shifter
- 1
- Sam Deghuee

### Library data of the parts
Q1 Q2 = CMP-1048-01396-1: Low Noise Transistor, NPN Silicon, 3-Pin TO-92, Pb-Free, Bulk Box; Manufacturer: On Semiconductor; IC Continuous (A): 0.2; fT Min (MHz): 100; PackageDescription: 3-Pin Transistor Outline, Body 4.825 x 3.685 mm, Pitch 1.27 mm; ComponentLink2URL: http://www.onsemi.cn/pub_link/Collateral/MPSA18-D.PDF; PackageVersion: Rev. AM; DatasheetVersion: Rev. 4; ComponentLink3URL: http://www.onsemi.cn/pub_link/Collateral/2N6426-D.PDF; Packing: Bulk Box; ComponentLink3Description: Package Specification; Polarity: NPN; RoHS: TRUE; ComponentLink2Description: Datasheet; ComponentLink1Description: Manufacturer URL; ComponentLink1URL: http://www.onsemi.com/; PartNumber: MPSA18G; Mounting Technology: Through Hole; PackageReference: TO-92-3-29-11_AM_SL
R10-R12 = CMP-1591-00001-1: as R13 on sheet MSP430; PackageReference: RESC0603(1608)

## Sheet RS485.SchDoc
size A
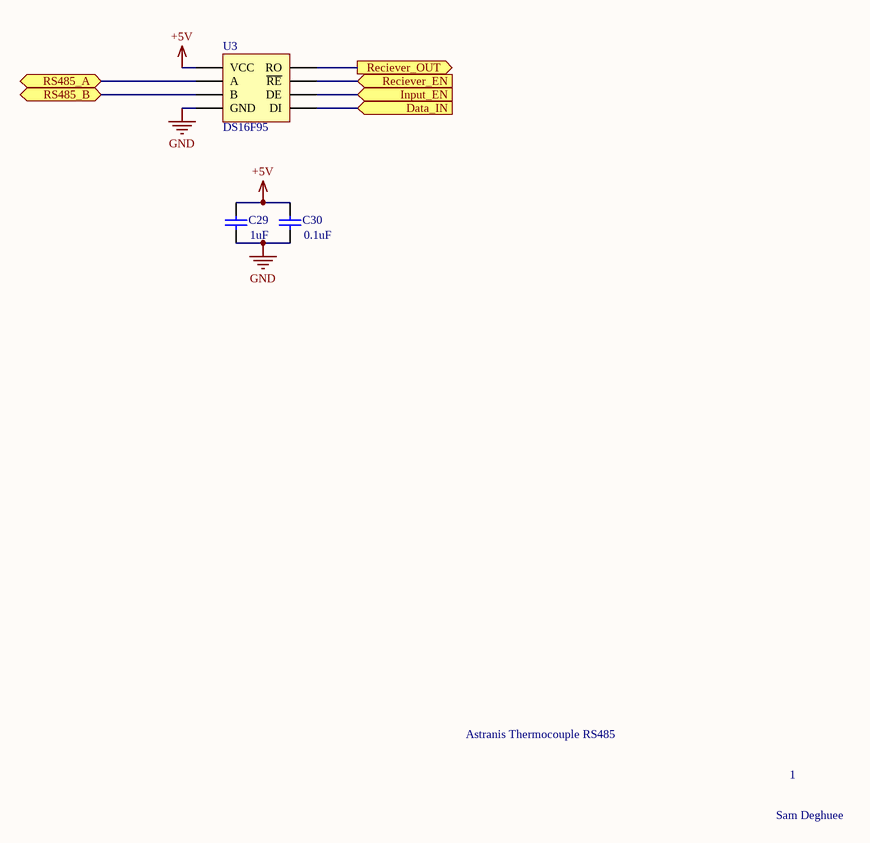
[diagram p5: RS485.SchDoc]

### Parts
C29  value 1uF  [CAPC0603(1608)100_L]  (hidden comment: CAP0603)
C30  value 0.1uF  [CAPC0603(1608)100_L]  (hidden comment: CAP0603)
U3  DS16F95

### Ports
Data_IN (in), Input_EN (in), Reciever_EN (in), Reciever_OUT (out), RS485_A (bidir), RS485_B (bidir)

### Nets
+5V: C29.2 C30.2 U3.?6(VCC)
GND: C29.1 C30.1 U3.?5(GND)
NetQ1_Designator#2_3: U3.?4(DI) ; port Data_IN
NetQ1_Designator#3_3: U3.?2(~{RE}) ; port Reciever_EN
NetQ1_Designator#4_3: U3.?3(DE) ; port Input_EN
NetR12_Designator#1_1: U3.?1(RO) ; port Reciever_OUT
NetU3_?7: U3.?7(A) ; port RS485_A
NetU3_?8: U3.?8(B) ; port RS485_B

### Notes on the sheet
- Astranis Thermocouple RS485
- 1
- Sam Deghuee

### Library data of the parts
C29 C30 = CMP-1590-00005-1: as C17 on sheet MSP430; PackageReference: CAPC0603(1608)100
U3 = DS16F95QML: The DS16F95 Differential Bus Transceiver is a monolithic integrated circuit designed for bidirectional data communication on balanced multipoint bus transmission lines. The transceiver meets EIA standard RS-485 as well as RS-422A.; ComponentLink1Description: Datasheet; ComponentLink1URL: http://www.ti.com/lit/ds/symlink/ds16f95qml-sp.pdf

## Sheet Power.SchDoc
size A
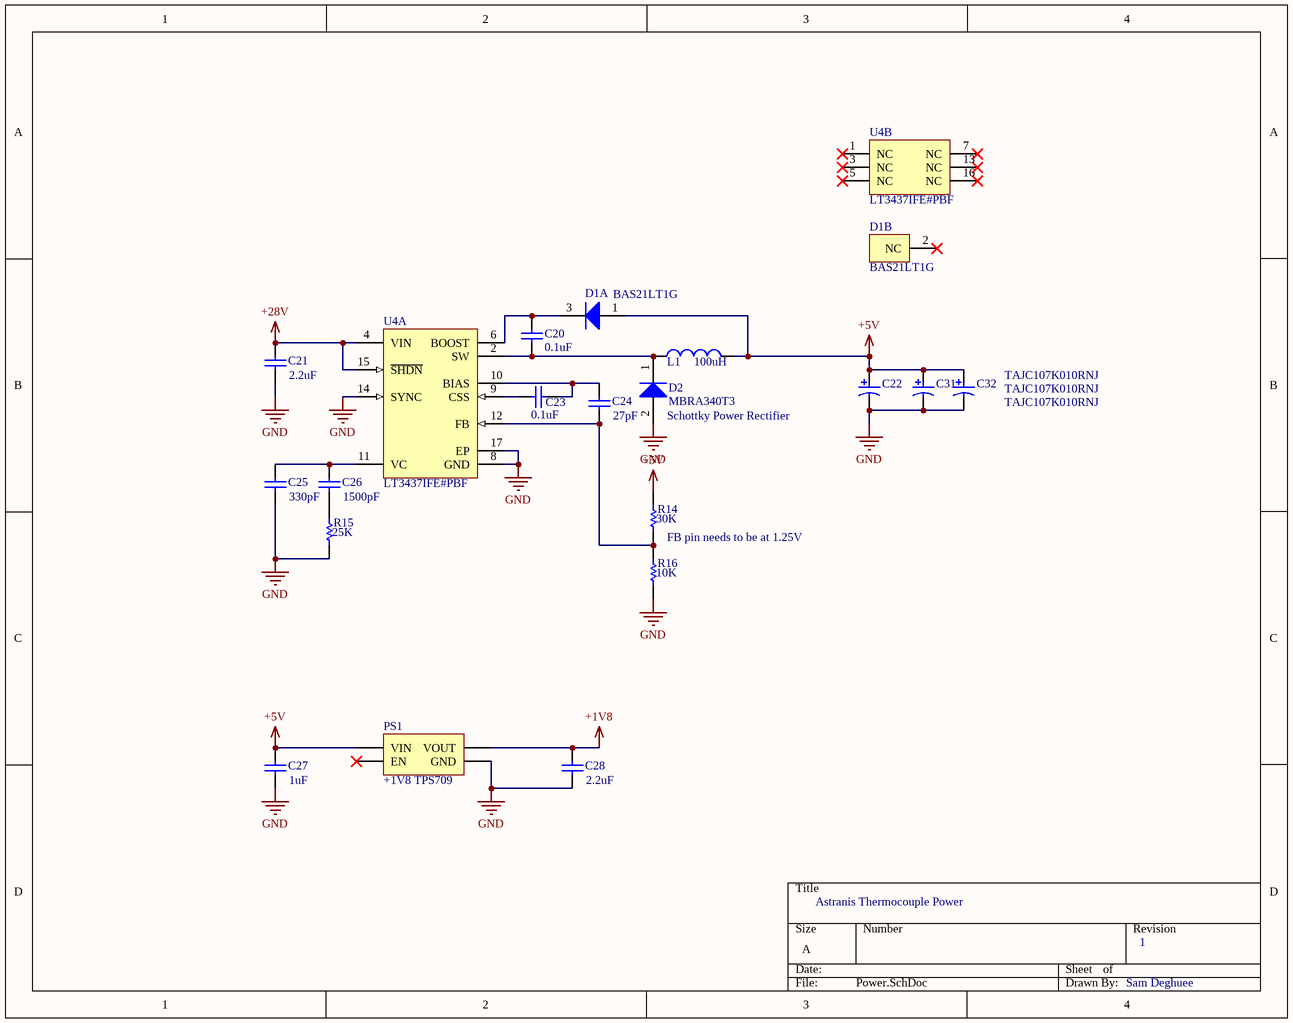
[diagram p6: Power.SchDoc]

### Parts
C20  value 0.1uF  [CAPC0603(1608)100_L]  (hidden comment: CAP0603)
C21  value 2.2uF  [CAPC0603(1608)100_L]  (hidden comment: CAP0603)
C22  TAJC107K010RNJ  [AVX-TAJ-C-2_M]
C23  value 0.1uF  [CAPC0603(1608)100_L]  (hidden comment: CAP0603)
C24  value 27pF  [CAPC0603(1608)100_L]  (hidden comment: CAP0603)
C25  value 330pF  [CAPC0603(1608)100_L]  (hidden comment: CAP0603)
C26  value 1500pF  [CAPC0603(1608)100_L]  (hidden comment: CAP0603)
C27  value 1uF  [CAPC0603(1608)100_L]  (hidden comment: CAP0603)
C28  value 2.2uF  [CAPC0603(1608)100_L]  (hidden comment: CAP0603)
C31  TAJC107K010RNJ  [AVX-TAJ-C-2_M]
C32  TAJC107K010RNJ  [AVX-TAJ-C-2_M]
D1  BAS21LT1G  [ONSC-SOT-23-3-318-08_V]  (parts A,B of 2)
D2  MBRA340T3  [ONSC-SMA-2-403D-02_F_V]
L1  Inductance: 100uH  [VISH-IHLP4040DZER101M11_V]  (hidden comment: IHLP4040DZER101M11)
PS1  +1V8 TPS709
R14  value 30K  [RESC0603(1608)_L]  (hidden comment: RES0603)
R15  value 25K  [RESC0603(1608)_L]  (hidden comment: RES0603)
R16  value 10K  [RESC0603(1608)_L]  (hidden comment: RES0603)
U4  LT3437IFE#PBF  [LT-FE-16-EPV-BC_M]  (parts A,B of 2)

### Nets
+1V8: C28.2 PS1.?2(VOUT)
+5V: C22.1 C27.2 C31.1 C32.1 D1.1(A) L1.2 PS1.?1(VIN) R14.2
+28V: C21.2 U4.4(VIN) U4.15(~{SHDN})
GND: C21.1 C22.2 C25.1 C27.1 C28.1 C31.2 C32.2 D2.2(A) PS1.?3(GND) R15.1 R16.1 U4.8(GND) U4.14(SYNC) U4.17(EP)
NetC20_1: C20.1 D1.3(K) U4.6(BOOST)
NetC20_2: C20.2 D2.1(K) L1.1 U4.2(SW)
NetC23_1: C23.1 C24.2 U4.10(BIAS)
NetC23_2: C23.2 U4.9(CSS)
NetC24_1: C24.1 R14.1 R16.2 U4.12(FB)
NetC25_2: C25.2 C26.2 U4.11(VC)
NetC26_1: C26.1 R15.2

Not connected (* = marked no-connect by the designer): D1 2(NC)*; PS1 ?4(EN)*; U4 1(NC)* 3(NC)* 5(NC)* 7(NC)* 13(NC)* 16(NC)*

### Notes on the sheet
- (near D2) Schottky Power Rectifier
- FB pin needs to be at 1.25V
- Astranis Thermocouple Power
- 1
- Sam Deghuee

### Library data of the parts
C20 C21 C23-C28 = CMP-1590-00005-1: as C17 on sheet MSP430; PackageReference: CAPC0603(1608)100
C22 C31 C32 = CMP-2100-03690-1: Standard Tantalum, 100 uF, +/- 10%, 10 V, -55 to 125 degC, 2-Pin SMD (2312), RoHS, Tape and Reel; Manufacturer: AVX; Capacitance: 100uF; Voltage Rating: 10V; ESR (Equivalent Series Resistance): 1.2Ohm; Polarity: Polar; Dissipation Factor: 8%; Leakage Current: 10uA; Height - Seated (Max): 0.11inch; Termination: SMD/SMT; RoHSCompliant: True; Length: 6mm; Max Operating Temperature: 125degC; Number of Pins: 2; Datasheet Version: 42401.0; Radiation Hardening: No; Package Description: 2-Pin Surface Mount Device, Body 6 x 3.25 mm; Case/Package: Molded; Datasheet URL: http://datasheets.avx.com/TAJ.pdf; Case Code (Metric): 6032; Manufacturer URL: http://www.avx.com/; Package Quantity: 1; Package Reference: TAJ-C-2; Width: 3.2mm; Packaging: TapeandReel; Depth: 3.2mm; Case Code (Imperial): 2412; REACH SVHC: NoSVHC; Height: 2.6mm; Dielectric Material: Tantalum; Voltage Rating (DC): 10V; Tolerance: 10%; Voltage: 10V; Lead Free: LeadFree; Min Operating Temperature: -55degC
D1 = CMP-1679-00004-3: DIODE SWITCH 200MA 250V SOT23; Manufacturer: ON Semiconductor; ComponentLink1Description: Datasheet; PackageReference: SOT-23-3-318-08; ComponentLink1URL: http://www.onsemi.com/pub_link/Collateral/BAS19LT1-D.PDF; PartNumber: BAS21LT1G; PartId: 1
D2 = CMP-1055-00314-1: Schottky Power Rectifier, 2-Pin SMA, Tape and Reel; Manufacturer: On Semiconductor; IFSM Max (A): 100; Configuration: Single; Mounting Technology: Surface Mount; PackageDescription: 2-Pin Small Molded Package, J-Bend Lead, Body 2.605 x 4.315 mm; PackageReference: SMA-2-403D-02_F; ComponentLink1URL: http://www.onsemi.com/; ComponentLink3Description: Package Specification; DatasheetVersion: Rev. 6; ComponentLink3URL: http://www.onsemi.com/pub_link/Collateral/1SMA5913BT3-D.PDF; ComponentLink2URL: http://www.onsemi.cn/pub_link/Collateral/MBRA340T3-D.PDF; PackageVersion: Rev. F, 11/2008; RoHS: FALSE; Packing: Tape and Reel; PartNumber: MBRA340T3; ComponentLink2Description: Datasheet; ComponentLink1Description: Manufacturer URL
L1 = CMP-2000-06447-1: Low Profile, High Current IHLP(R) Inductor, 100 uH, +/- 20%, 2.5 A, -55 to 125 degC, 2-Pin SMD, RoHS, Tape and Reel; Manufacturer: Vishay; Qualification: AEC-Q200; Test Frequency: 100kHz; Maximum DC Resistance: 270mOhms; Type: LowProfileHighCurrentIHLPInductor; Unit Weight: 0.070548oz; Shielding: Shielded; Brand: Vishay/Dale; Maximum DC Current: 2.25A; Termination Style: SMD/SMT; Mounting Style: SMD/SMT; Tolerance: 20%; Factory Pack Quantity: 500; Product Category: FixedInductors; Mounting Technology: SurfaceMount; Manufacturer URL: http://www.vishay.com/; Operating Temperature Range: -55Cto+125C; Datasheet Version: 08/2015; Product: PowerInductors; Packaging: Reel; Length: 10.3mm; Package Description: 2-Pin Surface Mount Device, Body 10.3 x 10.3 mm; Height: 4mm; Width: 10.3mm; Series: IHLP-4040DZ-11; RoHS: True; Package Reference: IHLP4040DZER101M11; Tradename: IHLP; Datasheet URL: http://www.vishay.com/docs/34192/lp40dz11.pdf; Package / Case: 4040
PS1 = TPS709: 150mA linear regulators, low dropout with reverse current protection; ComponentLink1Description: Datasheet; ComponentLink1URL: http://www.ti.com/lit/ds/symlink/tps709.pdf
R14-R16 = CMP-1591-00001-1: as R13 on sheet MSP430; PackageReference: RESC0603(1608)
U4 = CMP-0491-00587-1: High Voltage 500 mA, 200 kHz Step-Down Switching Regulator with 100 uA Quiescent Current, 16-pin SOP (FE-16), -40 to 125 degC, Pb-Free; Manufacturer: Linear Technology; Over Voltage Protection(V): 80; Number of Outputs: 1; Frequency Sync Range: 240kHz - 700kHz; PackageReference: FE-16; ComponentLink2Description: Datasheet; ComponentLink1Description: Manufacturer URL; ComponentLink1URL: http://www.linear.com/; ComponentLink3URL: http://cds.linear.com/docs/en/packaging/05081663__J_FE16(BC).pdf; Mounting Technology: Surface Mount; PackageVersion: Rev. J, 11/2012; PartNumber: LT3437IFE#PBF; DatasheetVersion: Rev. C; RoHS: TRUE; ComponentLink3Description: Package Specification; ComponentLink2URL: http://cds.linear.com/docs/en/datasheet/3437fc.pdf; PackageDescription: 16-Pin Plastic TSSOP, Body 5 x 4.4 mm, Pitch 0.65 mm; PartId: 1

## Nets that join several sheets
+1V8: MSP430 (6 pins), Designator (14 pins), Designator (8 pins), Designator (14 pins), Designator (8 pins), Designator (14 pins), Designator (8 pins), Designator (R10_Designator#1.1 R11_Designator#1.1), Power (C28.2 PS1.?2)
+5V: Designator (10 pins), Designator (10 pins), Designator (10 pins), Designator (R10_Designator#2.1 R11_Designator#2.1), RS485 (C29.2 C30.2 U3.?6), Designator (R10_Designator#3.1 R11_Designator#3.1), Designator (R10_Designator#4.1 R11_Designator#4.1), Power (8 pins)
GND: MSP430 (8 pins), Designator (33 pins), Designator (24 pins), Designator (33 pins), Designator (24 pins), Designator (34 pins), Designator (24 pins), Designator (Q1_Designator#1.1 Q2_Designator#1.1), Designator (Q1_Designator#2.1 Q2_Designator#2.1), RS485 (C29.1 C30.1 U3.?5), Designator (Q1_Designator#3.1 Q2_Designator#3.1), Designator (Q1_Designator#4.1 Q2_Designator#4.1), Power (14 pins)
CLK: MSP430 (U2.1), Designator (U1_Designator#1.?3), Designator (U1_Designator#2.?3), Designator (U1_Designator#3.?3)
NetJ1_Designator#1_?1: Designator (U1_Designator#1.?32), Designator (J1_Designator#1.?1 R1_Designator#1.1)
NetJ1_Designator#2_?1: Designator (U1_Designator#2.?32), Designator (J1_Designator#2.?1 R1_Designator#2.1)
NetJ1_Designator#3_?1: Designator (U1_Designator#3.?32), Designator (J1_Designator#3.?1 R1_Designator#3.1)
NetJ2_Designator#1_?1: Designator (U1_Designator#1.?36), Designator (J2_Designator#1.?1 R2_Designator#1.1)
NetJ2_Designator#2_?1: Designator (U1_Designator#2.?36), Designator (J2_Designator#2.?1 R2_Designator#2.1)
NetJ2_Designator#3_?1: Designator (U1_Designator#3.?36), Designator (J2_Designator#3.?1 R2_Designator#3.1)
NetJ3_Designator#1_?1: Designator (U1_Designator#1.?33), Designator (J3_Designator#1.?1 R3_Designator#1.1)
NetJ3_Designator#2_?1: Designator (U1_Designator#2.?33), Designator (J3_Designator#2.?1 R3_Designator#2.1)
NetJ3_Designator#3_?1: Designator (U1_Designator#3.?33), Designator (J3_Designator#3.?1 R3_Designator#3.1)
NetJ4_Designator#1_?1: Designator (U1_Designator#1.?37), Designator (J4_Designator#1.?1 R4_Designator#1.1)
NetJ4_Designator#2_?1: Designator (U1_Designator#2.?37), Designator (J4_Designator#2.?1 R4_Designator#2.1)
NetJ4_Designator#3_?1: Designator (U1_Designator#3.?37), Designator (J4_Designator#3.?1 R4_Designator#3.1)
NetJ5_Designator#1_?1: Designator (U1_Designator#1.?34), Designator (J5_Designator#1.?1 R5_Designator#1.1)
NetJ5_Designator#2_?1: Designator (U1_Designator#2.?34), Designator (J5_Designator#2.?1 R5_Designator#2.1)
NetJ5_Designator#3_?1: Designator (U1_Designator#3.?34), Designator (J5_Designator#3.?1 R5_Designator#3.1)
NetJ6_Designator#1_?1: Designator (U1_Designator#1.?38), Designator (J6_Designator#1.?1 R6_Designator#1.1)
NetJ6_Designator#2_?1: Designator (U1_Designator#2.?38), Designator (J6_Designator#2.?1 R6_Designator#2.1)
NetJ6_Designator#3_?1: Designator (U1_Designator#3.?38), Designator (J6_Designator#3.?1 R6_Designator#3.1)
NetJ7_Designator#1_?1: Designator (U1_Designator#1.?35), Designator (J7_Designator#1.?1 R7_Designator#1.1)
NetJ7_Designator#2_?1: Designator (U1_Designator#2.?35), Designator (J7_Designator#2.?1 R7_Designator#2.1)
NetJ7_Designator#3_?1: Designator (U1_Designator#3.?35), Designator (J7_Designator#3.?1 R7_Designator#3.1)
NetJ8_Designator#1_?1: Designator (U1_Designator#1.?39), Designator (J8_Designator#1.?1 R8_Designator#1.1)
NetJ8_Designator#2_?1: Designator (U1_Designator#2.?39), Designator (J8_Designator#2.?1 R8_Designator#2.1)
NetJ8_Designator#3_?1: Designator (U1_Designator#3.?39), Designator (J8_Designator#3.?1 R8_Designator#3.1)
NetQ1_Designator#2_3: Designator (Q1_Designator#2.3 R10_Designator#2.2), RS485 (U3.?4)
NetQ1_Designator#3_3: RS485 (U3.?2), Designator (Q1_Designator#3.3 R10_Designator#3.2)
NetQ1_Designator#4_3: RS485 (U3.?3), Designator (Q1_Designator#4.3 R10_Designator#4.2)
NetR12_Designator#1_1: Designator (R12_Designator#1.1), RS485 (U3.?1)
NetR12_Designator#3_1: MSP430 (U2.28), Designator (R12_Designator#3.1)
NetR12_Designator#4_1: MSP430 (U2.29), Designator (R12_Designator#4.1)
NetU1_Designator#1_?1: Designator (U1_Designator#1.?1), Designator (U1_Designator#2.?24)
NetU1_Designator#1_?2: MSP430 (U2.27), Designator (U1_Designator#1.?2)
NetU1_Designator#1_?4: MSP430 (U2.7), Designator (U1_Designator#1.?4), Designator (U1_Designator#2.?4), Designator (U1_Designator#3.?4)
NetU1_Designator#1_?13: MSP430 (U2.4), Designator (8 pins), Designator (8 pins), Designator (8 pins)
NetU1_Designator#1_?24: MSP430 (U2.25), Designator (U1_Designator#1.?24)
NetU1_Designator#1_SCLK: MSP430 (U2.11), Designator (U1_Designator#1.SCLK), Designator (U1_Designator#2.SCLK), Designator (U1_Designator#3.SCLK)
NetU1_Designator#2_?1: Designator (U1_Designator#2.?1), Designator (U1_Designator#3.?24)
UART_RX: MSP430 (U2.21), Designator (Q1_Designator#1.3 R10_Designator#1.2)
UART_TX: MSP430 (U2.20), Designator (R12_Designator#2.1)